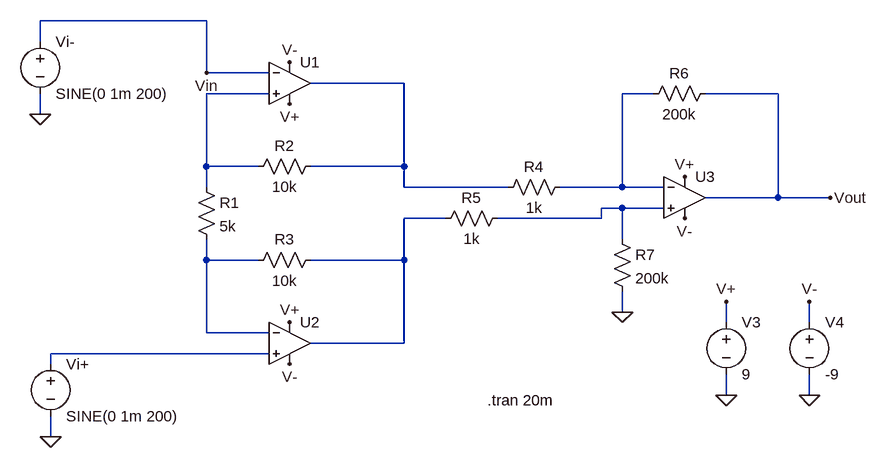
[diagram p0: schematic AMPLIFIER.asc]
AMPLIFIER.asc, the LTspice schematic file:
Version 4
SHEET 1 1016 680
WIRE -16 -112 -272 -112
WIRE -272 -80 -272 -112
WIRE -16 -32 -16 -112
WIRE 80 -32 -16 -32
WIRE 288 -16 144 -16
WIRE 80 0 -16 0
WIRE 672 0 624 0
WIRE 864 0 752 0
WIRE -272 32 -272 0
WIRE -16 112 -16 0
WIRE 64 112 -16 112
WIRE 288 112 288 -16
WIRE 288 112 144 112
WIRE -16 144 -16 112
WIRE 288 144 288 112
WIRE 448 144 288 144
WIRE 624 144 624 0
WIRE 624 144 528 144
WIRE 688 144 624 144
WIRE 864 160 864 0
WIRE 864 160 752 160
WIRE 944 160 864 160
WIRE 624 176 592 176
WIRE 688 176 624 176
WIRE 352 192 288 192
WIRE 592 192 592 176
WIRE 592 192 432 192
WIRE 624 224 624 176
WIRE -16 256 -16 224
WIRE 64 256 -16 256
WIRE 288 256 288 192
WIRE 288 256 144 256
WIRE 624 336 624 304
WIRE 784 352 784 320
WIRE 912 352 912 320
WIRE -16 368 -16 256
WIRE 80 368 -16 368
WIRE 288 384 288 256
WIRE 288 384 144 384
WIRE 80 400 -256 400
WIRE -256 416 -256 400
WIRE 784 464 784 432
WIRE 912 464 912 432
WIRE -256 528 -256 496
FLAG 624 336 0
FLAG -256 528 0
FLAG -272 32 0
FLAG 784 464 0
FLAG 912 464 0
FLAG 784 320 V+
FLAG 912 320 V-
FLAG 112 416 V-
FLAG 720 128 V+
FLAG 720 192 V-
FLAG 112 352 V+
FLAG 944 160 Vout
FLAG 112 16 V+
FLAG 112 -48 V-
FLAG -16 -32 Vin
SYMBOL OpAmps\\UniversalOpAmp2 112 -16 R0
SYMATTR InstName U1
SYMBOL res 160 96 R90
WINDOW 0 0 56 VBottom 2
WINDOW 3 32 56 VTop 2
SYMATTR InstName R2
SYMATTR Value 10k
SYMBOL res 160 240 R90
WINDOW 0 0 56 VBottom 2
WINDOW 3 32 56 VTop 2
SYMATTR InstName R3
SYMATTR Value 10k
SYMBOL res -32 128 R0
SYMATTR InstName R1
SYMATTR Value 5k
SYMBOL OpAmps\\UniversalOpAmp2 112 384 R0
SYMATTR InstName U2
SYMBOL res 544 128 R90
WINDOW 0 0 56 VBottom 2
WINDOW 3 32 56 VTop 2
SYMATTR InstName R4
SYMATTR Value 1k
SYMBOL res 336 208 R270
WINDOW 0 32 56 VTop 2
WINDOW 3 0 56 VBottom 2
SYMATTR InstName R5
SYMATTR Value 1k
SYMBOL OpAmps\\UniversalOpAmp2 720 160 R0
SYMATTR InstName U3
SYMBOL res 768 -16 R90
WINDOW 0 0 56 VBottom 2
WINDOW 3 32 56 VTop 2
SYMATTR InstName R6
SYMATTR Value 200k
SYMBOL res 608 208 R0
SYMATTR InstName R7
SYMATTR Value 200k
SYMBOL voltage -272 -96 R0
WINDOW 123 0 0 Left 0
WINDOW 39 0 0 Left 0
SYMATTR InstName Vi-
SYMATTR Value SINE(0 1m 200)
SYMBOL voltage -256 400 R0
WINDOW 123 0 0 Left 0
WINDOW 39 0 0 Left 0
SYMATTR InstName Vi+
SYMATTR Value SINE(0 1m 200)
SYMBOL voltage 784 336 R0
SYMATTR InstName V3
SYMATTR Value 9
SYMBOL voltage 912 336 R0
SYMATTR InstName V4
SYMATTR Value -9
TEXT 416 472 Left 2 !.tran 20m

The netlist it stands for:
* AMPLIFIER.asc
XU1 N002 Vin V- V+ N001 level2 Avol=1Meg GBW=10Meg Slew=10Meg Ilimit=25m Rail=0 Vos=0 En=0 Enk=0 In=0 Ink=0 Rin=500Meg  ; pins In+ In- V+ V- OUT
R2 N001 N002 10k
R3 N005 N006 10k
R1 N002 N006 5k
XU2 N007 N006 V+ V- N005 level2 Avol=1Meg GBW=10Meg Slew=10Meg Ilimit=25m Rail=0 Vos=0 En=0 Enk=0 In=0 Ink=0 Rin=500Meg  ; pins In+ In- V+ V- OUT
R4 N003 N001 1k
R5 N005 N004 1k
XU3 N004 N003 V+ V- Vout level2 Avol=1Meg GBW=10Meg Slew=10Meg Ilimit=25m Rail=0 Vos=0 En=0 Enk=0 In=0 Ink=0 Rin=500Meg  ; pins In+ In- V+ V- OUT
R6 Vout N003 200k
R7 N004 0 200k
Vi- Vin 0 SINE(0 1m 200)
Vi+ N007 0 SINE(0 1m 200)
V3 V+ 0 9
V4 V- 0 -9
.tran 20m
.lib UniversalOpAmp2.lib
.backanno
.end